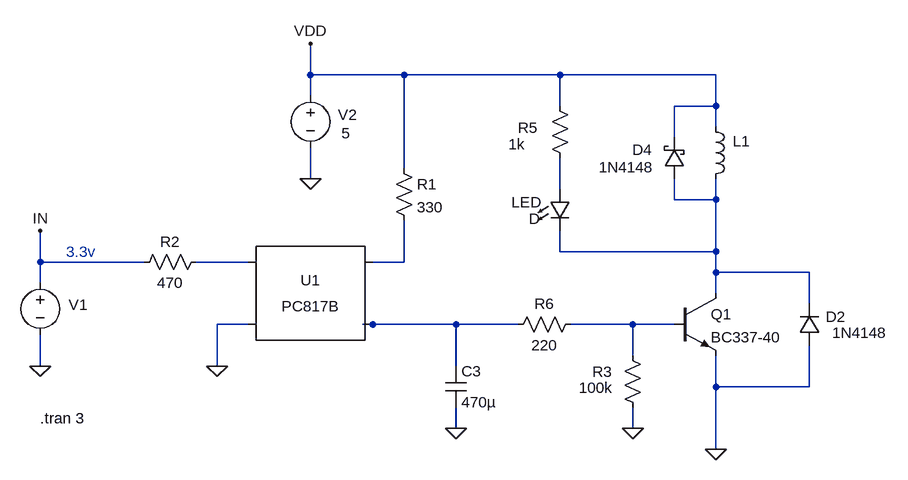
[diagram p0: schematic Reset_v1.0.asc]
Reset_v1.0.asc, the LTspice schematic file:
Version 4.1
SHEET 1 1408 680
WIRE 224 -160 224 -208
WIRE 368 -160 224 -160
WIRE 608 -160 368 -160
WIRE 848 -160 608 -160
WIRE 224 -128 224 -160
WIRE 608 -112 608 -160
WIRE 848 -112 848 -160
WIRE 848 -112 784 -112
WIRE 848 -80 848 -112
WIRE 784 -64 784 -112
WIRE 368 -16 368 -160
WIRE 224 0 224 -48
WIRE 608 16 608 -32
WIRE 784 32 784 0
WIRE 848 32 848 0
WIRE 848 32 784 32
WIRE 608 112 608 80
WIRE 848 112 848 32
WIRE 848 112 608 112
WIRE -192 128 -192 80
WIRE -32 128 -192 128
WIRE 128 128 48 128
WIRE 368 128 368 64
WIRE 368 128 320 128
WIRE 848 144 848 112
WIRE 992 144 848 144
WIRE -192 160 -192 128
WIRE 848 176 848 144
WIRE 992 192 992 144
WIRE 128 224 80 224
WIRE 320 224 304 224
WIRE 448 224 320 224
WIRE 544 224 448 224
WIRE 720 224 624 224
WIRE 784 224 720 224
WIRE 720 272 720 224
WIRE -192 288 -192 240
WIRE 80 288 80 224
WIRE 448 288 448 224
WIRE 848 320 848 272
WIRE 992 320 992 256
WIRE 992 320 848 320
WIRE 448 384 448 352
WIRE 720 384 720 352
WIRE 848 416 848 320
FLAG 80 288 0
FLAG -192 288 0
FLAG 224 0 0
FLAG -192 80 IN
FLAG 848 416 0
FLAG 224 -208 VDD
FLAG 720 384 0
FLAG 448 384 0
SYMBOL Optos\\PC817B 224 176 R0
SYMATTR InstName U1
SYMBOL res 352 -32 R0
SYMATTR InstName R1
SYMATTR Value 330
SYMBOL voltage -192 144 R0
WINDOW 123 0 0 Left 0
WINDOW 39 44 78 Left 2
WINDOW 0 44 50 Left 2
WINDOW 3 43 83 Invisible 2
SYMATTR InstName V1
SYMATTR Value PULSE(0 3.3 0.5 1n 1n 200m 4 1)
SYMBOL res -48 144 R270
WINDOW 0 32 56 VTop 2
WINDOW 3 0 56 VBottom 2
SYMATTR InstName R2
SYMATTR Value 470
SYMBOL voltage 224 -144 R0
WINDOW 123 0 0 Left 0
WINDOW 39 0 0 Left 0
WINDOW 0 42 45 Left 2
WINDOW 3 48 74 Left 2
SYMATTR InstName V2
SYMATTR Value 5
SYMBOL res 704 256 R0
WINDOW 0 -46 41 Left 2
WINDOW 3 -67 65 Left 2
SYMATTR InstName R3
SYMATTR Value 100k
SYMBOL ind 832 -96 R0
WINDOW 3 39 80 Invisible 2
WINDOW 0 42 38 Left 2
SYMATTR Value 250m
SYMATTR InstName L1
SYMATTR SpiceLine Rser=50
SYMBOL diode 1008 256 R180
WINDOW 0 -40 44 Left 2
WINDOW 3 -104 19 Left 2
SYMATTR InstName D2
SYMATTR Value 1N4148
SYMBOL LED 592 16 R0
WINDOW 0 -59 20 Left 2
WINDOW 3 -32 45 Left 2
SYMATTR InstName LED
SYMBOL res 592 -128 R0
WINDOW 0 -49 49 Left 2
WINDOW 3 -63 75 Left 2
SYMATTR InstName R5
SYMATTR Value 1k
SYMBOL schottky 800 0 R180
WINDOW 0 50 45 Left 2
WINDOW 3 47 18 Left 2
SYMATTR InstName D4
SYMATTR Value 1N4148
SYMBOL cap 432 288 R0
SYMATTR InstName C3
SYMATTR Value 470µ
SYMBOL res 528 240 R270
WINDOW 0 32 56 VTop 2
WINDOW 3 0 56 VBottom 2
SYMATTR InstName R6
SYMATTR Value 220
SYMBOL npn 784 176 R0
SYMATTR InstName Q1
SYMATTR Value BC337-40
TEXT -192 368 Left 2 !.tran 3
TEXT -152 112 Left 2 ;3.3v

The netlist it stands for:
* Reset_v1.0.asc
X§U1 N003 0 N004 N005 PC817 Igain=1.5m
R1 VDD N004 330
V1 IN 0 PULSE(0 3.3 0.5 1n 1n 200m 4 1)
R2 IN N003 470
V2 VDD 0 5
R3 N006 0 100k
L1 VDD N002 250m Rser=50
D2 0 N002 1N4148
D§LED N001 N002 D
R5 VDD N001 1k
D4 N002 VDD 1N4148
C3 N005 0 470µ
R6 N005 N006 220
Q1 N002 N006 0 0 BC337-40
.model D D
.lib standard.dio
.model NPN NPN
.model PNP PNP
.lib standard.bjt
.tran 3
* 3.3v
.lib PC817.sub
.backanno
.end